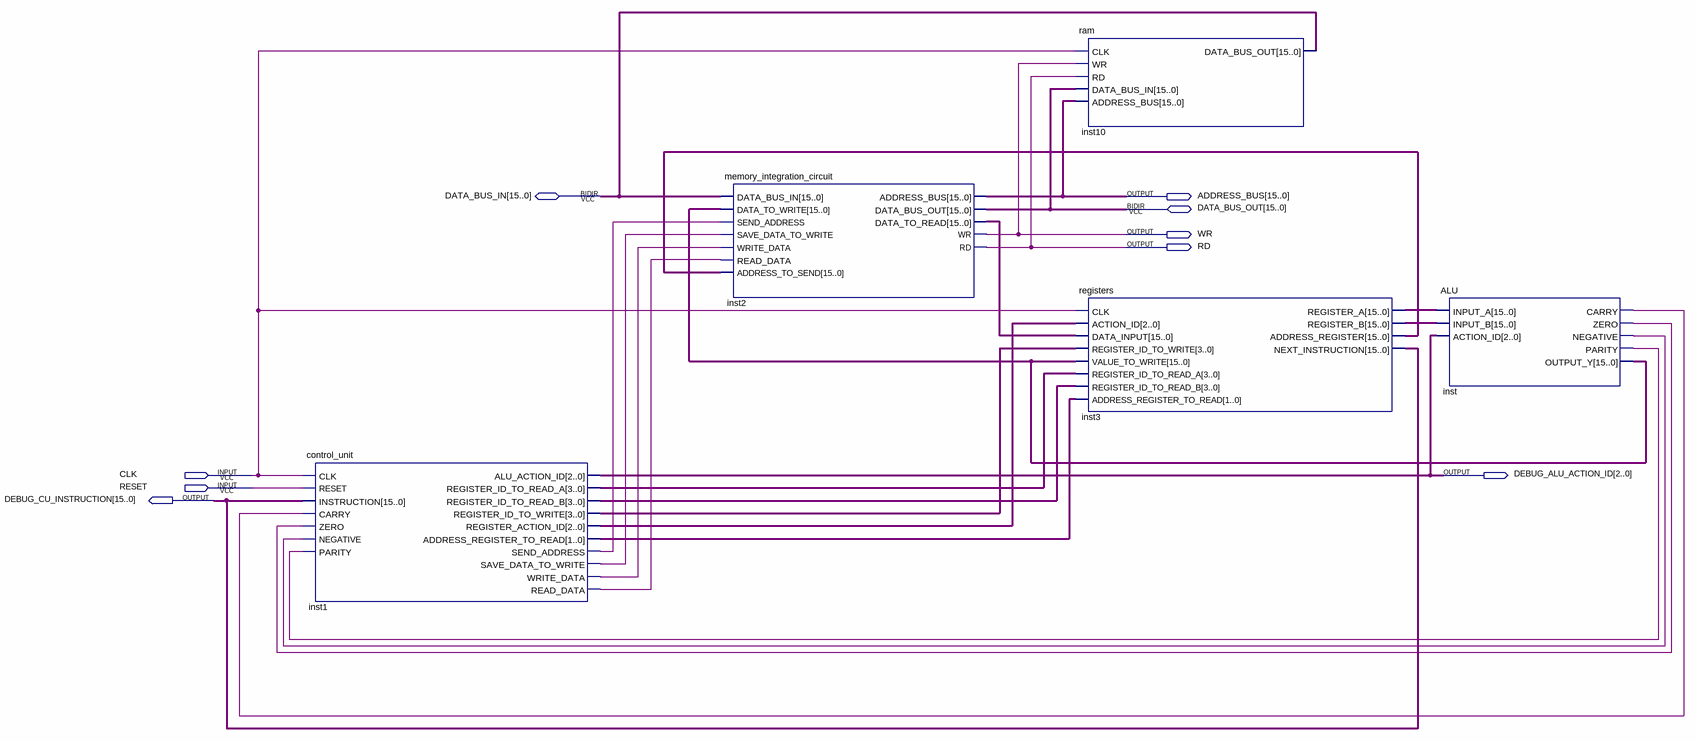
[diagram p0: schematic sheet]
// Quartus schematic my-cpu.bdf as structural Verilog: 5 symbols, 9 pins
module \my-cpu  (
  input  CLK,
  input  RESET,
  inout  [15:0] DATA_BUS_IN,
  inout  [15:0] DATA_BUS_OUT,
  output [15:0] ADDRESS_BUS,
  output WR,
  output RD,
  output [2:0] DEBUG_ALU_ACTION_ID,
  output [15:0] DEBUG_CU_INSTRUCTION
);

  wire inst1_read_data, inst1_save_data_to_write, inst1_send_address, inst1_write_data, inst_carry,
       inst_negative, inst_parity, inst_zero;
  wire [1:0] inst1_address_register_to_read;
  wire [2:0] inst1_register_action_id;
  wire [3:0] inst1_register_id_to_read_a, inst1_register_id_to_read_b, inst1_register_id_to_write;
  wire [15:0] inst2_data_to_read, inst3_address_register, inst3_register_a, inst3_register_b, inst_output_y;

  control_unit inst1 (
    .CLK(CLK), .RESET(RESET), .INSTRUCTION(DEBUG_CU_INSTRUCTION), .CARRY(inst_carry), .ZERO(inst_zero),
    .NEGATIVE(inst_negative), .PARITY(inst_parity), .ALU_ACTION_ID(DEBUG_ALU_ACTION_ID),
    .REGISTER_ID_TO_READ_A(inst1_register_id_to_read_a), .REGISTER_ID_TO_READ_B(inst1_register_id_to_read_b),
    .REGISTER_ID_TO_WRITE(inst1_register_id_to_write), .REGISTER_ACTION_ID(inst1_register_action_id),
    .ADDRESS_REGISTER_TO_READ(inst1_address_register_to_read), .SEND_ADDRESS(inst1_send_address),
    .SAVE_DATA_TO_WRITE(inst1_save_data_to_write), .WRITE_DATA(inst1_write_data), .READ_DATA(inst1_read_data));
  memory_integration_circuit inst2 (
    .DATA_BUS_IN(DATA_BUS_IN), .DATA_TO_WRITE(inst_output_y), .SEND_ADDRESS(inst1_send_address),
    .SAVE_DATA_TO_WRITE(inst1_save_data_to_write), .WRITE_DATA(inst1_write_data),
    .READ_DATA(inst1_read_data), .ADDRESS_TO_SEND(inst3_address_register), .ADDRESS_BUS(ADDRESS_BUS),
    .DATA_BUS_OUT(DATA_BUS_OUT), .DATA_TO_READ(inst2_data_to_read), .WR(WR), .RD(RD));
  ram inst10 (
    .CLK(CLK), .WR(WR), .RD(RD), .DATA_BUS_IN(DATA_BUS_OUT), .ADDRESS_BUS(ADDRESS_BUS),
    .DATA_BUS_OUT(DATA_BUS_IN));
  registers inst3 (
    .CLK(CLK), .ACTION_ID(inst1_register_action_id), .DATA_INPUT(inst2_data_to_read),
    .REGISTER_ID_TO_WRITE(inst1_register_id_to_write), .VALUE_TO_WRITE(inst_output_y),
    .REGISTER_ID_TO_READ_A(inst1_register_id_to_read_a), .REGISTER_ID_TO_READ_B(inst1_register_id_to_read_b),
    .ADDRESS_REGISTER_TO_READ(inst1_address_register_to_read), .REGISTER_A(inst3_register_a),
    .REGISTER_B(inst3_register_b), .ADDRESS_REGISTER(inst3_address_register),
    .NEXT_INSTRUCTION(DEBUG_CU_INSTRUCTION));
  ALU inst (
    .INPUT_A(inst3_register_a), .INPUT_B(inst3_register_b), .ACTION_ID(DEBUG_ALU_ACTION_ID),
    .CARRY(inst_carry), .ZERO(inst_zero), .NEGATIVE(inst_negative), .PARITY(inst_parity),
    .OUTPUT_Y(inst_output_y));
endmodule
